# Altium schematic sheet BUZZER.SchDoc
size A; SheetNumber: 12; SheetTotal: 12
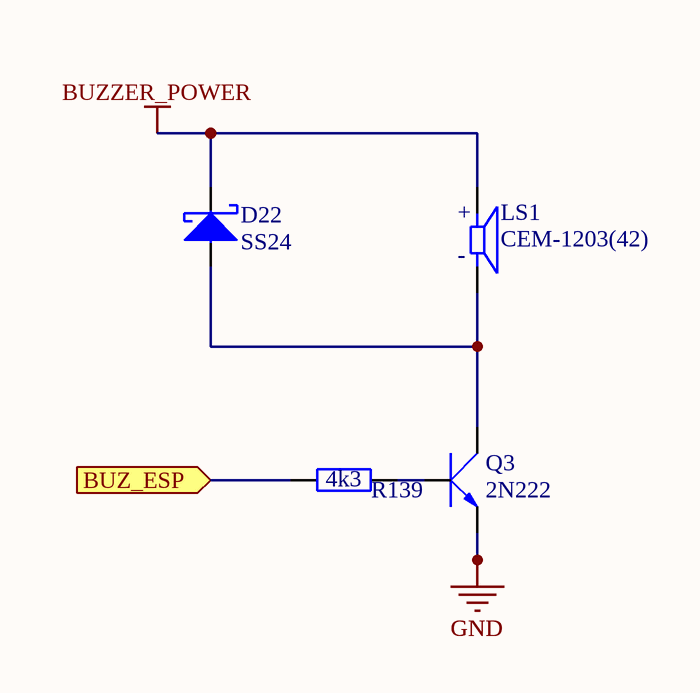
[diagram p0: BUZZER.SchDoc]

## Parts
D22  SS24  [DIO-SMD-106]
LS1  CEM-1203(42)  [CUI_CEM-1203(42)]
Q3  2N222  [SOT23-231]
R139  4k3  [0603_Res]

## Ports
BUZ_ESP (in)

## Nets
BUZZER_POWER: D22.2 LS1.P
GND: Q3.1(E)
BUZ_ESP: R139.1 ; port BUZ_ESP
NetD22_1: D22.1 LS1.N Q3.3(C)
NetQ3_2: Q3.2(B) R139.2

## Notes on the sheet
- (in symbol CEM-1203(42)) +; -

## Library data of the parts
D22 = Diode Schottky: Part Number: LED 3 ly Single Colour; Pricing: *
LS1 = CEM-1203(42): 12 mm, 3.5 V, 85 dB, Through Hole, Magnetic Audio Transducer Buzzer; MF: CUI Devices; Package: None; Price: None; Check_prices: https://www.snapeda.com/parts/CEM-1203(42)/CUI+Devices/view-part/?ref=eda; Value: *; CUI_purchase_URL: https://www.cuidevices.com/product/audio/buzzers/audio-transducers/cem-1203(42)?utm_source=snapeda.com&utm_medium=referral&utm_campaign=snapedaBOM; SnapEDA_Link: https://www.snapeda.com/parts/CEM-1203(42)/CUI+Devices/view-part/?ref=snap; MP: CEM-1203(42); Availability: In Stock; Purchase-URL: https://pricing.snapeda.com/search/part/CEM-1203(42)/?ref=eda
Q3 = 2N222: NPN 600mW, ECB; Value: C1815
R139 = Resistor: Chung_Loai: Dán; Don_Vi: Con; So_Chan: 2; Ten_Linh_Kien: Trở 0805 1% 1k; Ma_Hang: MH005468; Kieu_Chan: *